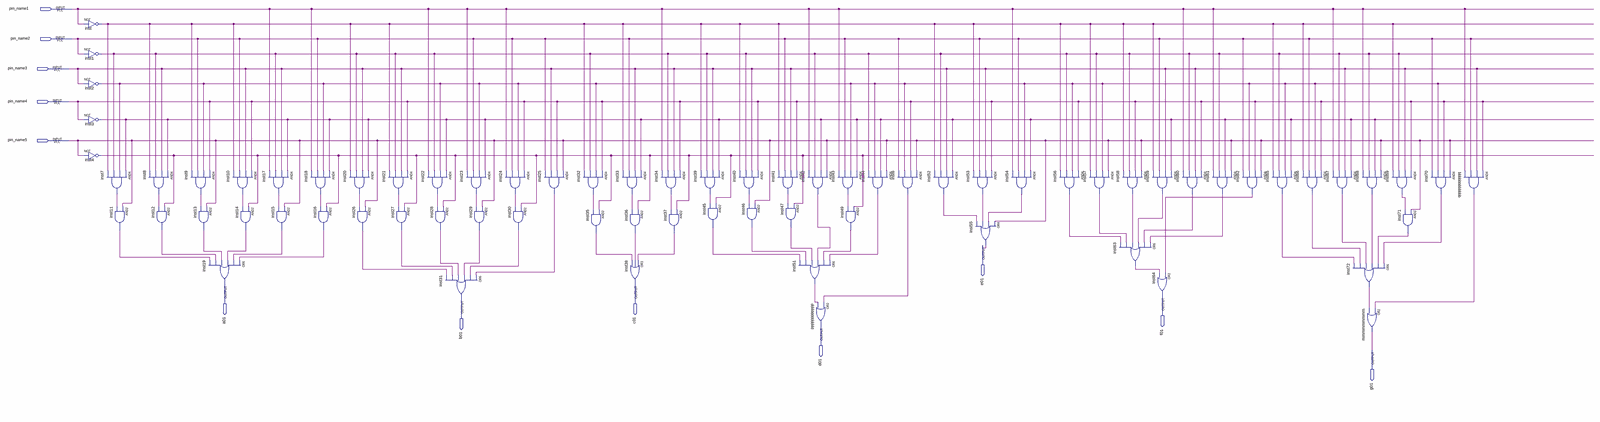
[diagram p0: schematic sheet, whole]
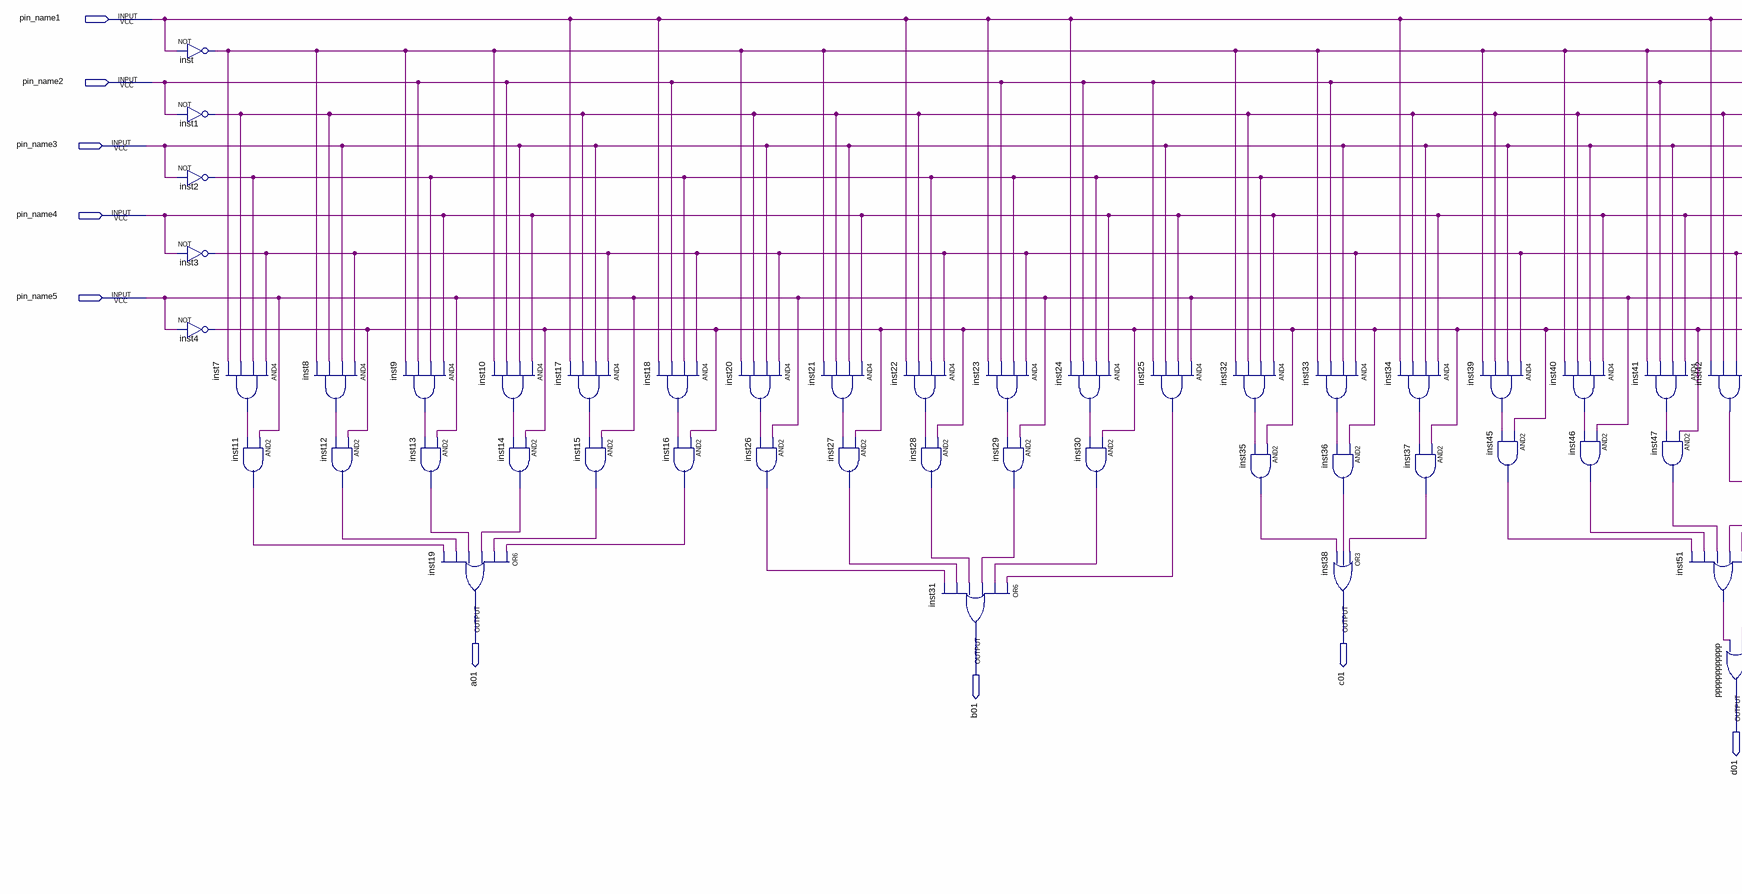
[diagram p1: schematic sheet, left part]
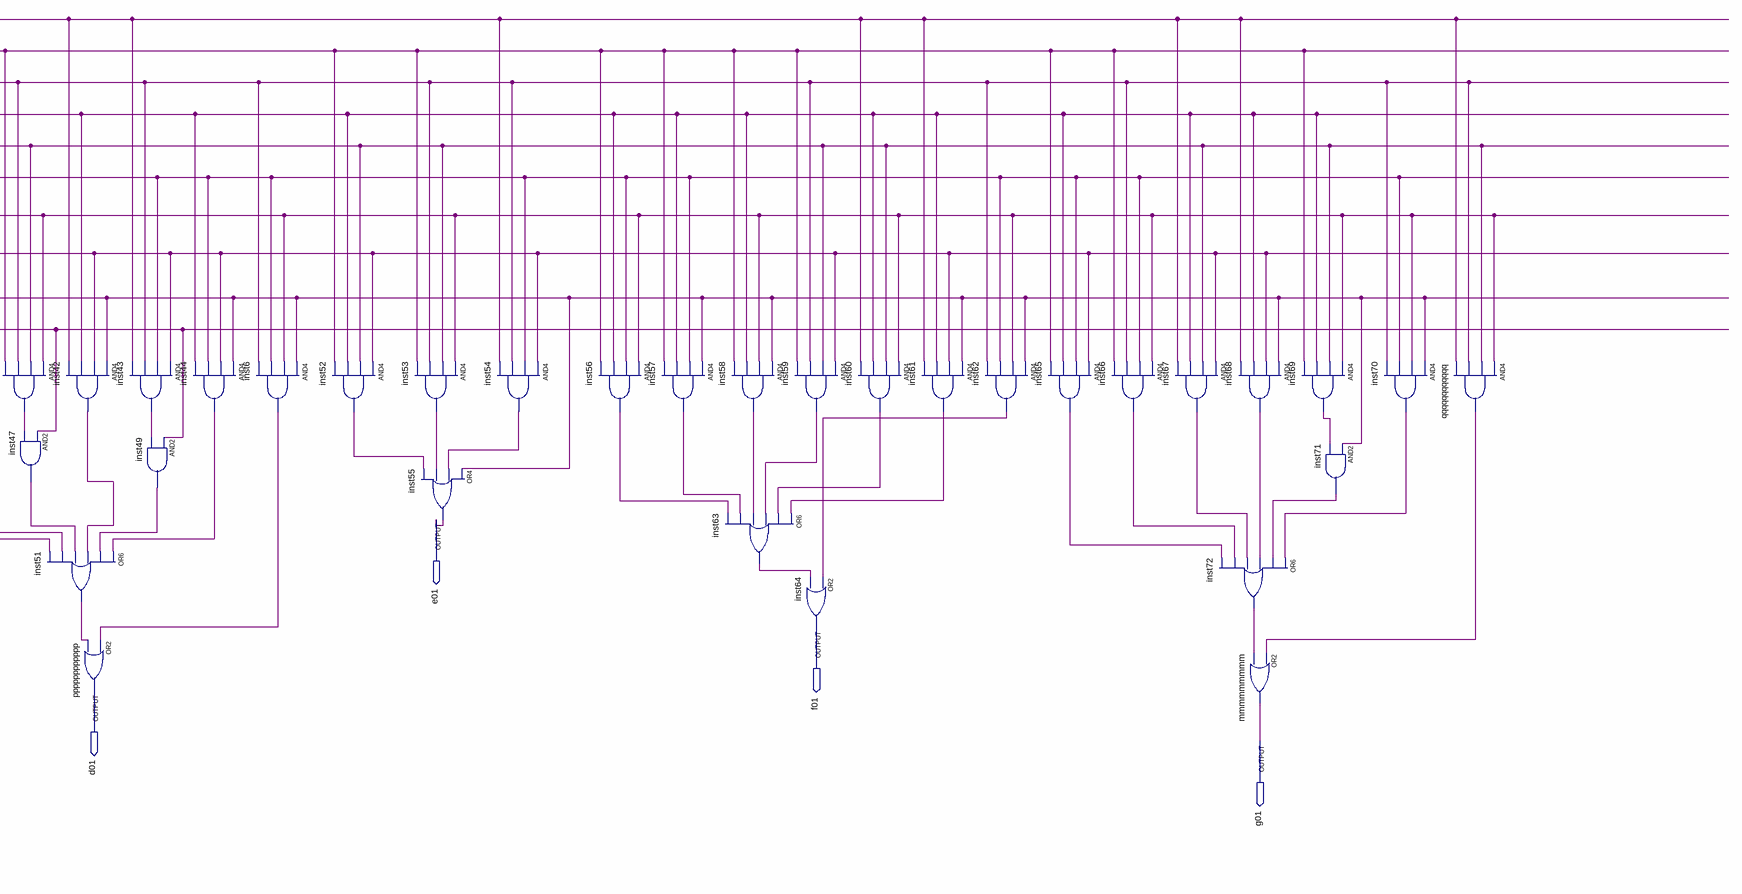
[diagram p2: schematic sheet, right part]
// Quartus schematic unidade30final.bdf as structural Verilog: 73 symbols, 12 pins
module unidade30final (
  input  pin_name1,
  input  pin_name2,
  input  pin_name3,
  input  pin_name4,
  input  pin_name5,
  output e01,
  output a01,
  output c01,
  output f01,
  output b01,
  output d01,
  output g01
);

  wire inst1_out, inst2_out, inst3_out, inst4_out, inst6_out, inst7_out, inst8_out, inst9_out, inst10_out,
       inst11_out, inst12_out, inst13_out, inst14_out, inst15_out, inst16_out, inst17_out, inst18_out,
       inst20_out, inst21_out, inst22_out, inst23_out, inst24_out, inst25_out, inst26_out, inst27_out,
       inst28_out, inst29_out, inst30_out, inst32_out, inst33_out, inst34_out, inst35_out, inst36_out,
       inst37_out, inst39_out, inst40_out, inst41_out, inst42_out, inst43_out, inst44_out, inst45_out,
       inst46_out, inst47_out, inst49_out, inst51_out, inst52_out, inst53_out, inst54_out, inst56_out,
       inst57_out, inst58_out, inst59_out, inst60_out, inst61_out, inst62_out, inst63_out, inst65_out,
       inst66_out, inst67_out, inst68_out, inst69_out, inst70_out, inst71_out, inst72_out, inst_out,
       qqqqqqqqqqqq_out;

  not inst (inst_out, pin_name1);
  not inst1 (inst1_out, pin_name2);
  not inst2 (inst2_out, pin_name3);
  not inst3 (inst3_out, pin_name4);
  not inst4 (inst4_out, pin_name5);
  and inst7 (inst7_out, inst3_out, inst2_out, inst1_out, inst_out);
  and inst11 (inst11_out, pin_name5, inst7_out);
  and inst8 (inst8_out, inst3_out, pin_name3, inst1_out, inst_out);
  and inst12 (inst12_out, inst4_out, inst8_out);
  and inst9 (inst9_out, pin_name4, inst2_out, pin_name2, inst_out);
  and inst13 (inst13_out, pin_name5, inst9_out);
  or inst19 (a01, inst16_out, inst15_out, inst14_out, inst13_out, inst12_out, inst11_out);
  and inst10 (inst10_out, pin_name4, pin_name3, pin_name2, inst_out);
  and inst14 (inst14_out, inst4_out, inst10_out);
  and inst17 (inst17_out, inst3_out, pin_name3, inst1_out, pin_name1);
  and inst15 (inst15_out, pin_name5, inst17_out);
  and inst18 (inst18_out, inst3_out, inst2_out, pin_name2, pin_name1);
  and inst16 (inst16_out, inst4_out, inst18_out);
  and inst20 (inst20_out, inst3_out, pin_name3, inst1_out, inst_out);
  and inst26 (inst26_out, pin_name5, inst20_out);
  and inst21 (inst21_out, pin_name4, pin_name3, inst1_out, inst_out);
  and inst27 (inst27_out, inst4_out, inst21_out);
  and inst22 (inst22_out, inst3_out, inst2_out, inst1_out, pin_name1);
  and inst28 (inst28_out, inst4_out, inst22_out);
  or inst31 (b01, inst25_out, inst30_out, inst29_out, inst28_out, inst27_out, inst26_out);
  and inst23 (inst23_out, inst3_out, inst2_out, pin_name2, pin_name1);
  and inst29 (inst29_out, pin_name5, inst23_out);
  and inst24 (inst24_out, pin_name4, inst2_out, pin_name2, pin_name1);
  and inst30 (inst30_out, inst4_out, inst24_out);
  and inst25 (inst25_out, pin_name5, pin_name4, pin_name3, pin_name2);
  and inst32 (inst32_out, pin_name4, inst2_out, inst1_out, inst_out);
  and inst35 (inst35_out, inst4_out, inst32_out);
  and inst33 (inst33_out, inst3_out, pin_name3, pin_name2, inst_out);
  and inst36 (inst36_out, inst4_out, inst33_out);
  or inst38 (c01, inst37_out, inst36_out, inst35_out);
  and inst34 (inst34_out, pin_name4, pin_name3, inst1_out, pin_name1);
  and inst37 (inst37_out, inst4_out, inst34_out);
  and inst39 (inst39_out, inst3_out, pin_name3, inst1_out, inst_out);
  and inst45 (inst45_out, inst4_out, inst39_out);
  and inst40 (inst40_out, pin_name4, pin_name3, inst1_out, inst_out);
  and inst46 (inst46_out, pin_name5, inst40_out);
  and inst41 (inst41_out, pin_name4, pin_name3, pin_name2, inst_out);
  and inst47 (inst47_out, inst4_out, inst41_out);
  and inst42 (inst42_out, pin_name5, inst3_out, inst1_out, pin_name1);
  or inst51 (inst51_out, inst44_out, inst49_out, inst42_out, inst47_out, inst46_out, inst45_out);
  or pppppppppppp (d01, inst6_out, inst51_out);
  and inst43 (inst43_out, inst3_out, inst2_out, pin_name2, pin_name1);
  and inst49 (inst49_out, inst4_out, inst43_out);
  and inst44 (inst44_out, pin_name5, inst3_out, inst2_out, inst1_out);
  and inst6 (inst6_out, pin_name5, pin_name4, inst2_out, pin_name2);
  and inst52 (inst52_out, inst3_out, pin_name3, inst1_out, inst_out);
  and inst53 (inst53_out, pin_name4, pin_name3, pin_name2, inst_out);
  or inst55 (e01, pin_name5, inst54_out, inst53_out, inst52_out);
  and inst54 (inst54_out, inst3_out, inst2_out, pin_name2, pin_name1);
  and inst56 (inst56_out, pin_name4, inst2_out, inst1_out, inst_out);
  and inst57 (inst57_out, pin_name5, inst2_out, inst1_out, inst_out);
  and inst58 (inst58_out, pin_name5, pin_name4, inst1_out, inst_out);
  or inst63 (inst63_out, inst61_out, inst60_out, inst59_out, inst58_out, inst57_out, inst56_out);
  and inst59 (inst59_out, inst3_out, pin_name3, pin_name2, inst_out);
  or inst64 (f01, inst62_out, inst63_out);
  and inst60 (inst60_out, pin_name4, pin_name3, inst1_out, pin_name1);
  and inst61 (inst61_out, pin_name5, inst3_out, inst1_out, pin_name1);
  and inst62 (inst62_out, pin_name5, pin_name4, inst2_out, pin_name2);
  and inst65 (inst65_out, inst3_out, inst2_out, inst1_out, inst_out);
  and inst66 (inst66_out, pin_name4, inst2_out, pin_name2, inst_out);
  and inst67 (inst67_out, inst3_out, pin_name3, inst1_out, pin_name1);
  and inst68 (inst68_out, pin_name5, inst3_out, inst1_out, pin_name1);
  or inst72 (inst72_out, inst70_out, inst71_out, inst68_out, inst67_out, inst66_out, inst65_out);
  or mmmmmmmmm (g01, qqqqqqqqqqqq_out, inst72_out);
  and inst69 (inst69_out, pin_name4, pin_name3, inst1_out, inst_out);
  and inst71 (inst71_out, pin_name5, inst69_out);
  and inst70 (inst70_out, pin_name5, pin_name4, inst2_out, pin_name2);
  and qqqqqqqqqqqq (qqqqqqqqqqqq_out, pin_name4, pin_name3, pin_name2, pin_name1);
endmodule
